# Altium schematic sheet fpc_1.SchDoc
size A; SheetNumber: 1; SheetTotal: 1
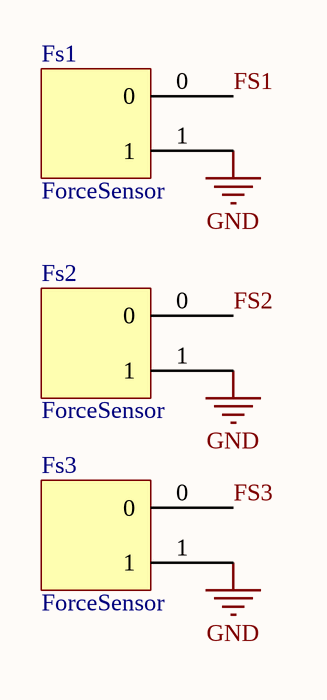
[diagram p0: fpc_1.SchDoc]

## Parts
Fs1  ForceSensor  [sensor_connector]
Fs2  ForceSensor  [sensor_connector]
Fs3  ForceSensor  [sensor_connector]

## Nets
GND: Fs1.1 Fs2.1 Fs3.1
FS1: Fs1.0
FS2: Fs2.0
FS3: Fs3.0